# EAGLE schematic Connection (EAGLE 9.6.2)
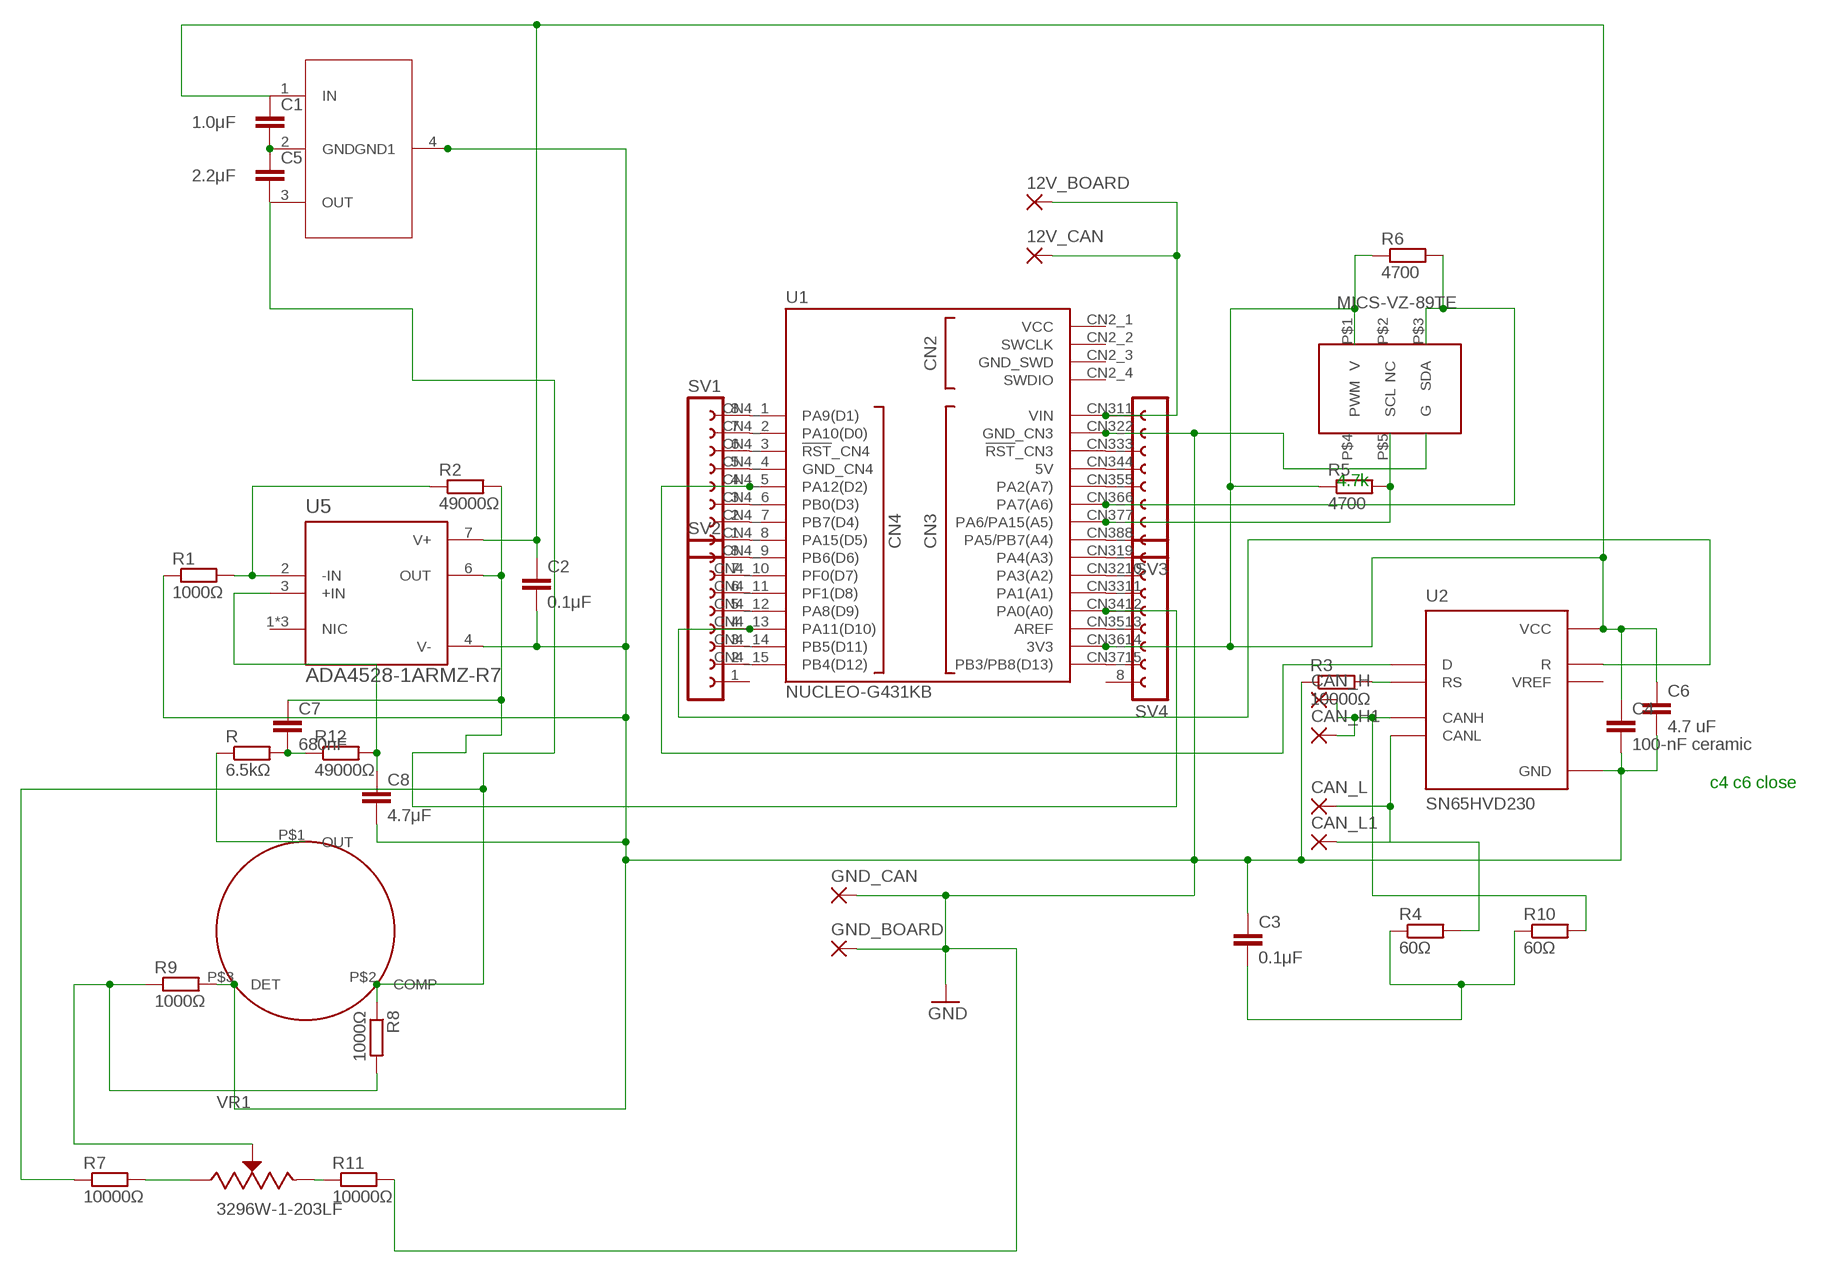
[diagram p0: schematic, sheet 1]

## Parts
12V_BOARD  1,6/0,8  [1,6/0,8]
12V_CAN  1,6/0,8  [1,6/0,8]
C1  1.0μF  C2,5-3  [C2.5-3]
C2  0.1μF  C2,5-3  [C2.5-3]
C3  0.1μF  C2,5-3  [C2.5-3]
C4  100-nF ceramic  C2,5-3  [C2.5-3]
C5  2.2μF  C2,5-3  [C2.5-3]
C6  4.7 uF  C2,5-3  [C2.5-3]
C7  680nF  C2,5-3  [C2.5-3]
C8  4.7μF  C2,5-3  [C2.5-3]
CAN_H  1,6/0,8  [1,6/0,8]
CAN_H1  1,6/0,8  [1,6/0,8]
CAN_L  1,6/0,8  [1,6/0,8]
CAN_L1  1,6/0,8  [1,6/0,8]
GND_BOARD  1,6/0,8  [1,6/0,8]
GND_CAN  1,6/0,8  [1,6/0,8]
R  6.5kΩ  R-EU_0207/10  [0207/10]
R1  1000Ω  R-EU_0207/10  [0207/10]
R2  49000Ω  R-EU_0207/10  [0207/10]
R3  10000Ω  R-EU_0207/10  [0207/10]
R4  60Ω  R-EU_0207/10  [0207/10]
R5  4700  R-EU_0207/10  [0207/10]
R6  4700  R-EU_0207/10  [0207/10]
R7  10000Ω  R-EU_0207/10  [0207/10]
R8  1000Ω  R-EU_0207/10  [0207/10]
R9  1000Ω  R-EU_0207/10  [0207/10]
R10  60Ω  R-EU_0207/10  [0207/10]
R11  10000Ω  R-EU_0207/10  [0207/10]
R12  49000Ω  R-EU_0207/10  [0207/10]
SV1  FE08-1  [FE08]
SV2  FE08-1  [FE08]
SV3  FE08-1  [FE08]
SV4  FE08-1  [FE08]
U1  NUCLEO-G431KB  [MODULE_NUCLEO-G431KB]
U2  SN65HVD230  [SOIC127P599X175-8N]
U5  ADA4528-1ARMZ-R7  [SOP65P490X110-8N]
U$1  MP7227  [MP7227_FP]
U$2  MIC5233-3PIN  [SOT230P700X180-4N]
U$4  MICS-VZ-89TE  [MICS-VZ-89TE_FP]
VR1  3296W-1-203LF  [TRIM_3296W-1-203LF]

## Nets
GND: C2.2 C3.1 C4.2 C6.2 C8.2 GND_BOARD.1(P) GND_CAN.1(P) R1.1 R3.1 R9.2 R11.2 SV3.2 U1.CN3_2(GND_CN3) U2.2(GND) U5.4(V-) U$1.P$3(DET) U$4.P$6(G)
N$1: 12V_BOARD.1(P) 12V_CAN.1(P) SV3.1 U1.CN3_1(VIN)
N$2: R5.2 SV3.7 U1.CN3_7(PA6/PA15(A5)) U$4.P$5(SCL)
N$3: R6.2 SV3.6 U1.CN3_6(PA7(A6)) U$4.P$3(SDA)
N$4: R1.2 R2.1 U5.2(-IN)
N$5: R.1 U$1.P$1(OUT)
N$6: CAN_H1.1(P) CAN_H.1(P) R10.2 U2.7(CANH)
N$7: CAN_L1.1(P) CAN_L.1(P) R4.2 U2.6(CANL)
N$8: C1.1 C2.1 C4.1 C6.1 R5.1 R6.1 SV4.6 U1.CN3_14(3V3) U2.3(VCC) U5.7(V+) U$2.1(IN) U$4.P$1(V)
N$9: SV1.4 U1.CN4_5(PA12(D2)) U2.1(D)
N$10: SV2.4 U1.CN4_13(PA11(D10)) U2.4(R)
N$11: R3.2 U2.8(RS)
N$12: C3.2 R4.1 R10.1
N$13: C7.1 R2.2 SV4.4 U1.CN3_12(PA0(A0)) U5.6(OUT)
N$14: C5.1 U$2.2(GND)
N$15: R8.2 R9.1 VR1.2(WIPER)
N$16: C7.2 R12.1 R.2
N$17: C5.2 R7.1 R8.1 U$1.P$2(COMP) U$2.3(OUT)
N$18: SV3.3 U1.CN3_3(!RST!_CN3)
N$19: SV3.4 U1.CN3_4(5V)
N$20: SV3.5 U1.CN3_5(PA2(A7))
N$21: SV3.8 U1.CN3_8(PA5/PB7(A4))
N$22: SV4.1 U1.CN3_9(PA4(A3))
N$23: SV4.2 U1.CN3_10(PA3(A2))
N$24: SV4.3 U1.CN3_11(PA1(A1))
N$25: SV4.5 U1.CN3_13(AREF)
N$26: SV4.7 U1.CN3_15(PB3/PB8(D13))
N$27: SV1.1 U1.CN4_8(PA15(D5))
N$28: SV1.2 U1.CN4_7(PB7(D4))
N$29: SV1.3 U1.CN4_6(PB0(D3))
N$30: SV1.5 U1.CN4_4(GND_CN4)
N$31: SV1.6 U1.CN4_3(!RST!_CN4)
N$32: SV1.7 U1.CN4_2(PA10(D0))
N$33: SV1.8 U1.CN4_1(PA9(D1))
N$34: SV2.2 U1.CN4_15(PB4(D12))
N$35: SV2.3 U1.CN4_14(PB5(D11))
N$36: SV2.5 U1.CN4_12(PA8(D9))
N$37: SV2.6 U1.CN4_11(PF1(D8))
N$38: SV2.7 U1.CN4_10(PF0(D7))
N$39: SV2.8 U1.CN4_9(PB6(D6))
N$40: C1.2 U$2.4(GND1)
N$41: R7.2 VR1.1(CCW)
N$42: R11.1 VR1.3(CW)
N$43: C8.1 R12.2 U5.3(+IN)
Unconnected: SV2.1 SV4.8 U1.CN2_2(SWCLK) U1.CN2_4(SWDIO) U2.5(VREF) U5.1(NIC) U5.5(NIC) U5.8(NIC) U$4.P$2(NC) U$4.P$4(PWM)

## Notes on the sheet
- 4.7k
- c4 c6 close

## Power pins joined to a net without a drawn wire
GND_SWD: U1.CN2_3(GND_SWD)
VCC: U1.CN2_1(VCC)

## Library data of the parts
12V_BOARD 12V_CAN CAN_H CAN_H1 CAN_L CAN_L1 GND_BOARD GND_CAN = wirepad:1,6/0,8: THROUGH-HOLE PAD
C1-C8 = capacitor-wima:C: CAPACITOR naming: grid - package width
R R1-R12 = rcl:R-EU_: RESISTOR, European symbol; SPICEPREFIX: R
SV1-SV4 = con-lsta:FE08-1: FEMALE HEADER; OC_FARNELL: unknown; OC_NEWARK: unknown
U1 = NUCLEO-G431KB:NUCLEO-G431KB: Check availability <https://pricing.snapeda.com/parts/NUCLEO-G431KB/STMicroelectronics/view-part?ref=eda>; AVAILABILITY: In Stock; CHECK_PRICES: https://www.snapeda.com/parts/NUCLEO-G431KB/STMicroelectronics/view-part/?ref=eda; DESCRIPTION: STM32G431 Nucleo-32 STM32G4 ARM® Cortex®-M4 MCU 32-Bit Embedded Evaluation Board; MF: STMicroelectronics; MP: NUCLEO-G431KB; PACKAGE: None; PRICE: None; SNAPEDA_LINK: https://www.snapeda.com/parts/NUCLEO-G431KB/STMicroelectronics/view-part/?ref=snap
U2 = SN65HVD230:SN65HVD230: Check availability <https://pricing.snapeda.com/parts/SN65HVD230/Texas%20Instruments/view-part?ref=eda>; AVAILABILITY: In Stock; CHECK_PRICES: https://www.snapeda.com/parts/SN65HVD230/Texas+Instruments/view-part/?ref=eda; DESCRIPTION: 1/1 Transceiver Half CANbus 8-SOIC; MF: Texas Instruments; MP: SN65HVD230; PACKAGE: SOIC-8 Texas Instruments; PRICE: None; SNAPEDA_LINK: https://www.snapeda.com/parts/SN65HVD230/Texas+Instruments/view-part/?ref=snap
U5 = ADA4528-1ARMZ-R7:ADA4528-1ARMZ-R7: Check availability <https://pricing.snapeda.com/parts/ADA4528-1ARMZ-R7/Analog%20Devices/view-part?ref=eda>; AVAILABILITY: In Stock; CHECK_PRICES: https://www.snapeda.com/parts/ADA4528-1ARMZ-R7/Analog+Devices/view-part/?ref=eda; DESCRIPTION: Precision, Ultralow Noise, RRIO, Zero-Drift Single Op Amp; MF: Analog Devices; MP: ADA4528-1ARMZ-R7; PACKAGE: MSOP-8 Analog Devices; PRICE: None; SNAPEDA_LINK: https://www.snapeda.com/parts/ADA4528-1ARMZ-R7/Analog+Devices/view-part/?ref=snap
U$1 = MP7227:MP7227
U$2 = MIC5233-3.3YS:MIC5233-3PIN
U$4 = MICS-VZ-89TE:MICS-VZ-89TE
VR1 = 3296W-1-203LF:3296W-1-203LF: Check availability <https://pricing.snapeda.com/parts/3296W-1-203LF/Bourns/view-part?ref=eda>; AVAILABILITY: In Stock; CHECK_PRICES: https://www.snapeda.com/parts/3296W-1-203LF/Bourns/view-part/?ref=eda; DESCRIPTION: Trimmer, Cermet, Rest 20 Kilohms, PCB, 25 Turns, Pwr-Rtg 0.5W | Bourns 3296W-1-203LF; MF: Bourns; MP: 3296W-1-203LF; PACKAGE: NON STANDARD-3 Bourns; PRICE: None; SNAPEDA_LINK: https://www.snapeda.com/parts/3296W-1-203LF/Bourns/view-part/?ref=snap